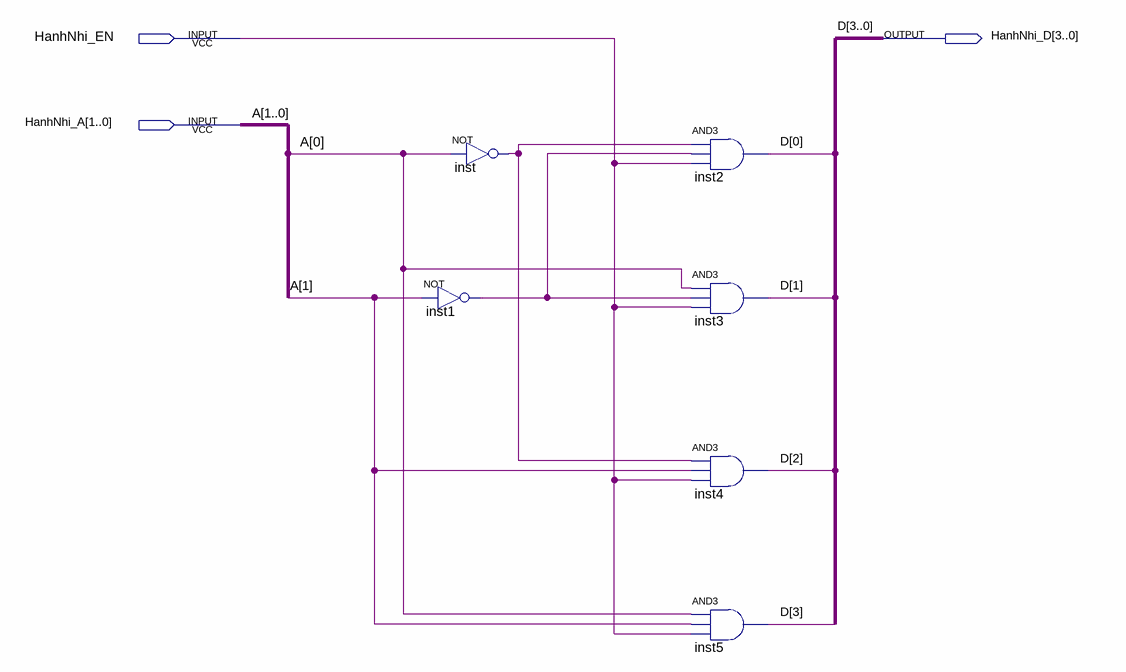
[diagram p0: schematic sheet]
// Quartus schematic Assignment1.bdf as structural Verilog: 6 symbols, 3 pins
module Assignment1 (
  input  HanhNhi_EN,
  input  [1:0] HanhNhi_A,
  output [3:0] HanhNhi_D
);

  wire inst1_out, inst_out;

  not inst1 (inst1_out, HanhNhi_A[1]);
  not inst (inst_out, HanhNhi_A[0]);
  and inst2 (HanhNhi_D[0], inst_out, inst1_out, HanhNhi_EN);
  and inst3 (HanhNhi_D[1], HanhNhi_A[0], inst1_out, HanhNhi_EN);
  and inst4 (HanhNhi_D[2], inst_out, HanhNhi_A[1], HanhNhi_EN);
  and inst5 (HanhNhi_D[3], HanhNhi_A[0], HanhNhi_A[1], HanhNhi_EN);

  // Other names for the same wires on the sheet: A[1:0] = HanhNhi_A; D[3:0] = HanhNhi_D
endmodule
